# EAGLE design rev1_v1 (EAGLE 9.5.1)
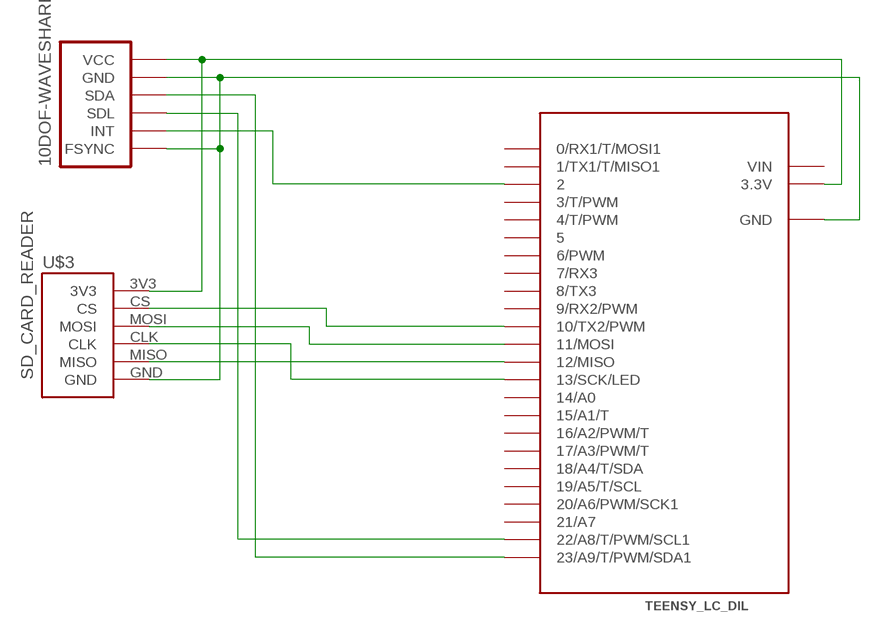
[diagram p0: schematic, sheet 1]

## Parts
U$1  TEENSY_LC_DIL  [TEENSY_3.0-3.2&LC_DIL]
U$2  10DOF-WAVESHARE  [10DOF-WAVESHARE]
U$3  SD_CARD_READER  [MICRO_SD_READER_3V3]

## Nets
N$1: U$1.3.3V U$2.VCC U$3.3V3
N$2: U$1.AGND(GND) U$1.GND U$2.FSYNC U$2.GND U$3.GND
N$3: U$1.23/A9(23/A9/T/PWM/SDA1) U$2.SDA
N$4: U$1.22/A8(22/A8/T/PWM/SCL1) U$2.SCL(SDL)
N$5: U$1.2 U$2.INT
N$6: U$1.11(11/MOSI) U$3.MOSI
N$7: U$1.13(13/SCK/LED) U$3.CLK
N$8: U$1.12(12/MISO) U$3.MISO
N$9: U$1.10(10/TX2/PWM) U$3.CS
Unconnected: U$1.0(0/RX1/T/MOSI1) U$1.1(1/TX1/T/MISO1) U$1.3(3/T/PWM) U$1.4(4/T/PWM) U$1.5 U$1.6(6/PWM) U$1.7(7/RX3) U$1.8(8/TX3) U$1.9(9/RX2/PWM) U$1.14/A0 U$1.15/A1(15/A1/T) U$1.16/A2(16/A2/PWM/T) U$1.17/A3(17/A3/PWM/T) U$1.18/A4(18/A4/T/SDA) U$1.19/A5(19/A5/T/SCL) U$1.20/A6(20/A6/PWM/SCK1) U$1.21/A7

## Power pins joined to a net without a drawn wire
VIN: U$1.VIN

## Library data of the parts
U$1 = Teensy_3_and_LC_Series_Boards_v1.4:TEENSY_LC_DIL
U$2 = macrocketry_2019:10DOF-WAVESHARE
U$3 = macrocketry_2019:SD_CARD_READER

## Board
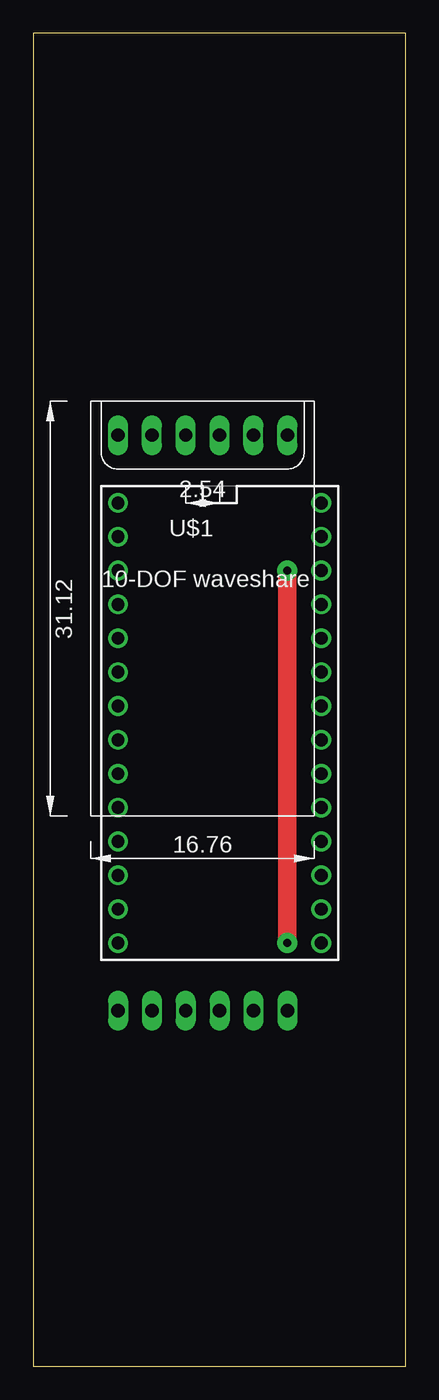
[diagram p1: board, top side]
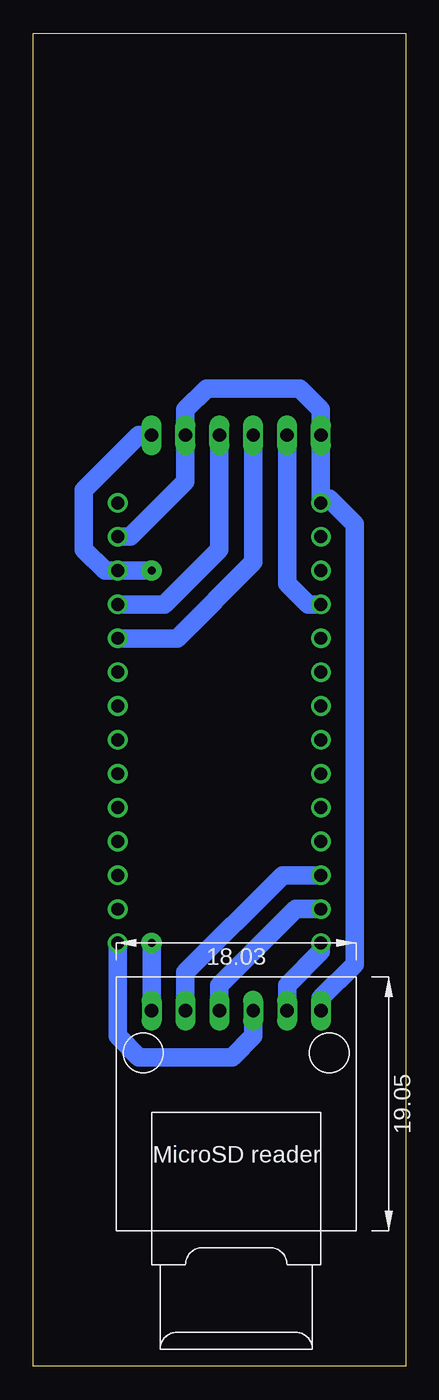
[diagram p2: board, bottom side, seen from below]

Size 27.92 x 100 mm. Coordinates in mm from the lower left corner, seen from the top.
Outline: 0,0 27.92,0 27.92,100 0,100 0,0
Copper layers (1*16): Top 0.035mm / dielectric 1.5mm / Bottom 0.035mm
Design rules "default *": minimum track width 54mil, minimum drill 0.35mm, track to track 40mil, track to pad 40mil, pad to pad 6mil, via to via 6mil, smd to smd 6mil, copper to edge 40mil, drill to drill 6mil, minimum pad ring 10mil, minimum via ring 8mil, stop-mask expansion 4mil, vias tented up to drill 0mil, thermal gap 10mil

### Footprints (pad centres in the part's own frame; a part is rotated, then mirrored left to right if it is on the bottom)
TEENSY_3.0-3.2&LC_DIL = drill 0.965: 0 -7.62,13.97; 1 -7.62,11.43; 2 -7.62,8.89; 3 -7.62,6.35; 3.3V 7.62,11.43; 4 -7.62,3.81; 5 -7.62,1.27; 6 -7.62,-1.27; 7 -7.62,-3.81; 8 -7.62,-6.35; 9 -7.62,-8.89; 10 -7.62,-11.43; 11 -7.62,-13.97; 12 -7.62,-16.51; 13 7.62,-16.51; 14/A0 7.62,-13.97; 15/A1 7.62,-11.43; 16/A2 7.62,-8.89; 17/A3 7.62,-6.35; 18/A4 7.62,-3.81; 19/A5 7.62,-1.27; 20/A6 7.62,1.27; 21/A7 7.62,3.81; 22/A8 7.62,6.35; 23/A9 7.62,8.89; AGND 7.62,13.97; GND -7.62,16.51; VIN 7.62,16.51
10DOF-WAVESHARE = drill 1 long: FSYNC -13.97,-6.35; GND -13.97,3.81; INT -13.97,-3.81; SCL -13.97,-1.27; SDA -13.97,1.27; VCC -13.97,6.35
MICRO_SD_READER_3V3 = drill 1 long: 3V3 5.08,6.35; CLK 5.08,-1.27; CS 5.08,3.81; GND 5.08,-6.35; MISO 5.08,-3.81; MOSI 5.08,1.27

### Placement (x,y rotation side)
U$1  13.97,48.26 0 top
U$2  12.7,55.88 270 top
U$3  12.7,21.59 90 bottom

### Tracks (layer width: path | path; a pad name or v marks a point on that pad's centre or on a via)
N$1  (via drill 0.6 pad 1.52)
  Top 1.372: v19.05,59.69 v19.05,31.75
  Bottom 1.372: v19.05,59.69 U$1.3.3V 22.54,59.69 24.13,61.28 24.13,65.72 20,69.85 U$2.VCC | v19.05,31.75 U$3.3V3
N$2
  Bottom 1.372: U$1.AGND 20.64,62.23 16.51,66.36 U$2.GND 16.51,71.75 14.92,73.34 7.94,73.34 6.35,71.75 U$2.FSYNC U$1.GND 5.71,65.09 3.81,63.18 3.81,30.16 6.35,27.62 U$3.GND
N$3
  Bottom 1.372: U$1.23/A9 18.1,57.15 13.97,61.28 U$2.SDA
N$4
  Bottom 1.372: U$1.22/A8 17.14,54.61 11.43,60.33 U$2.SCL
N$5
  Bottom 1.372: U$1.2 7.3,57.15 8.89,58.74 U$2.INT
N$6
  Bottom 1.372: U$1.11 8.26,34.29 13.97,28.57 U$3.MOSI
N$7
  Bottom 1.372: U$1.13 21.59,24.77 20,23.18 13.02,23.18 11.43,24.77 U$3.CLK
N$8
  Bottom 1.372: U$1.12 6.35,31.11 8.89,28.57 U$3.MISO
N$9
  Bottom 1.372: U$1.10 9.21,36.83 16.51,29.53 U$3.CS